# Altium schematic sheet Choin_tran1_0.SchDoc
size A3; DocumentNumber: 3; SheetNumber: 3; SheetTotal: 4; LotOfPieces: 1
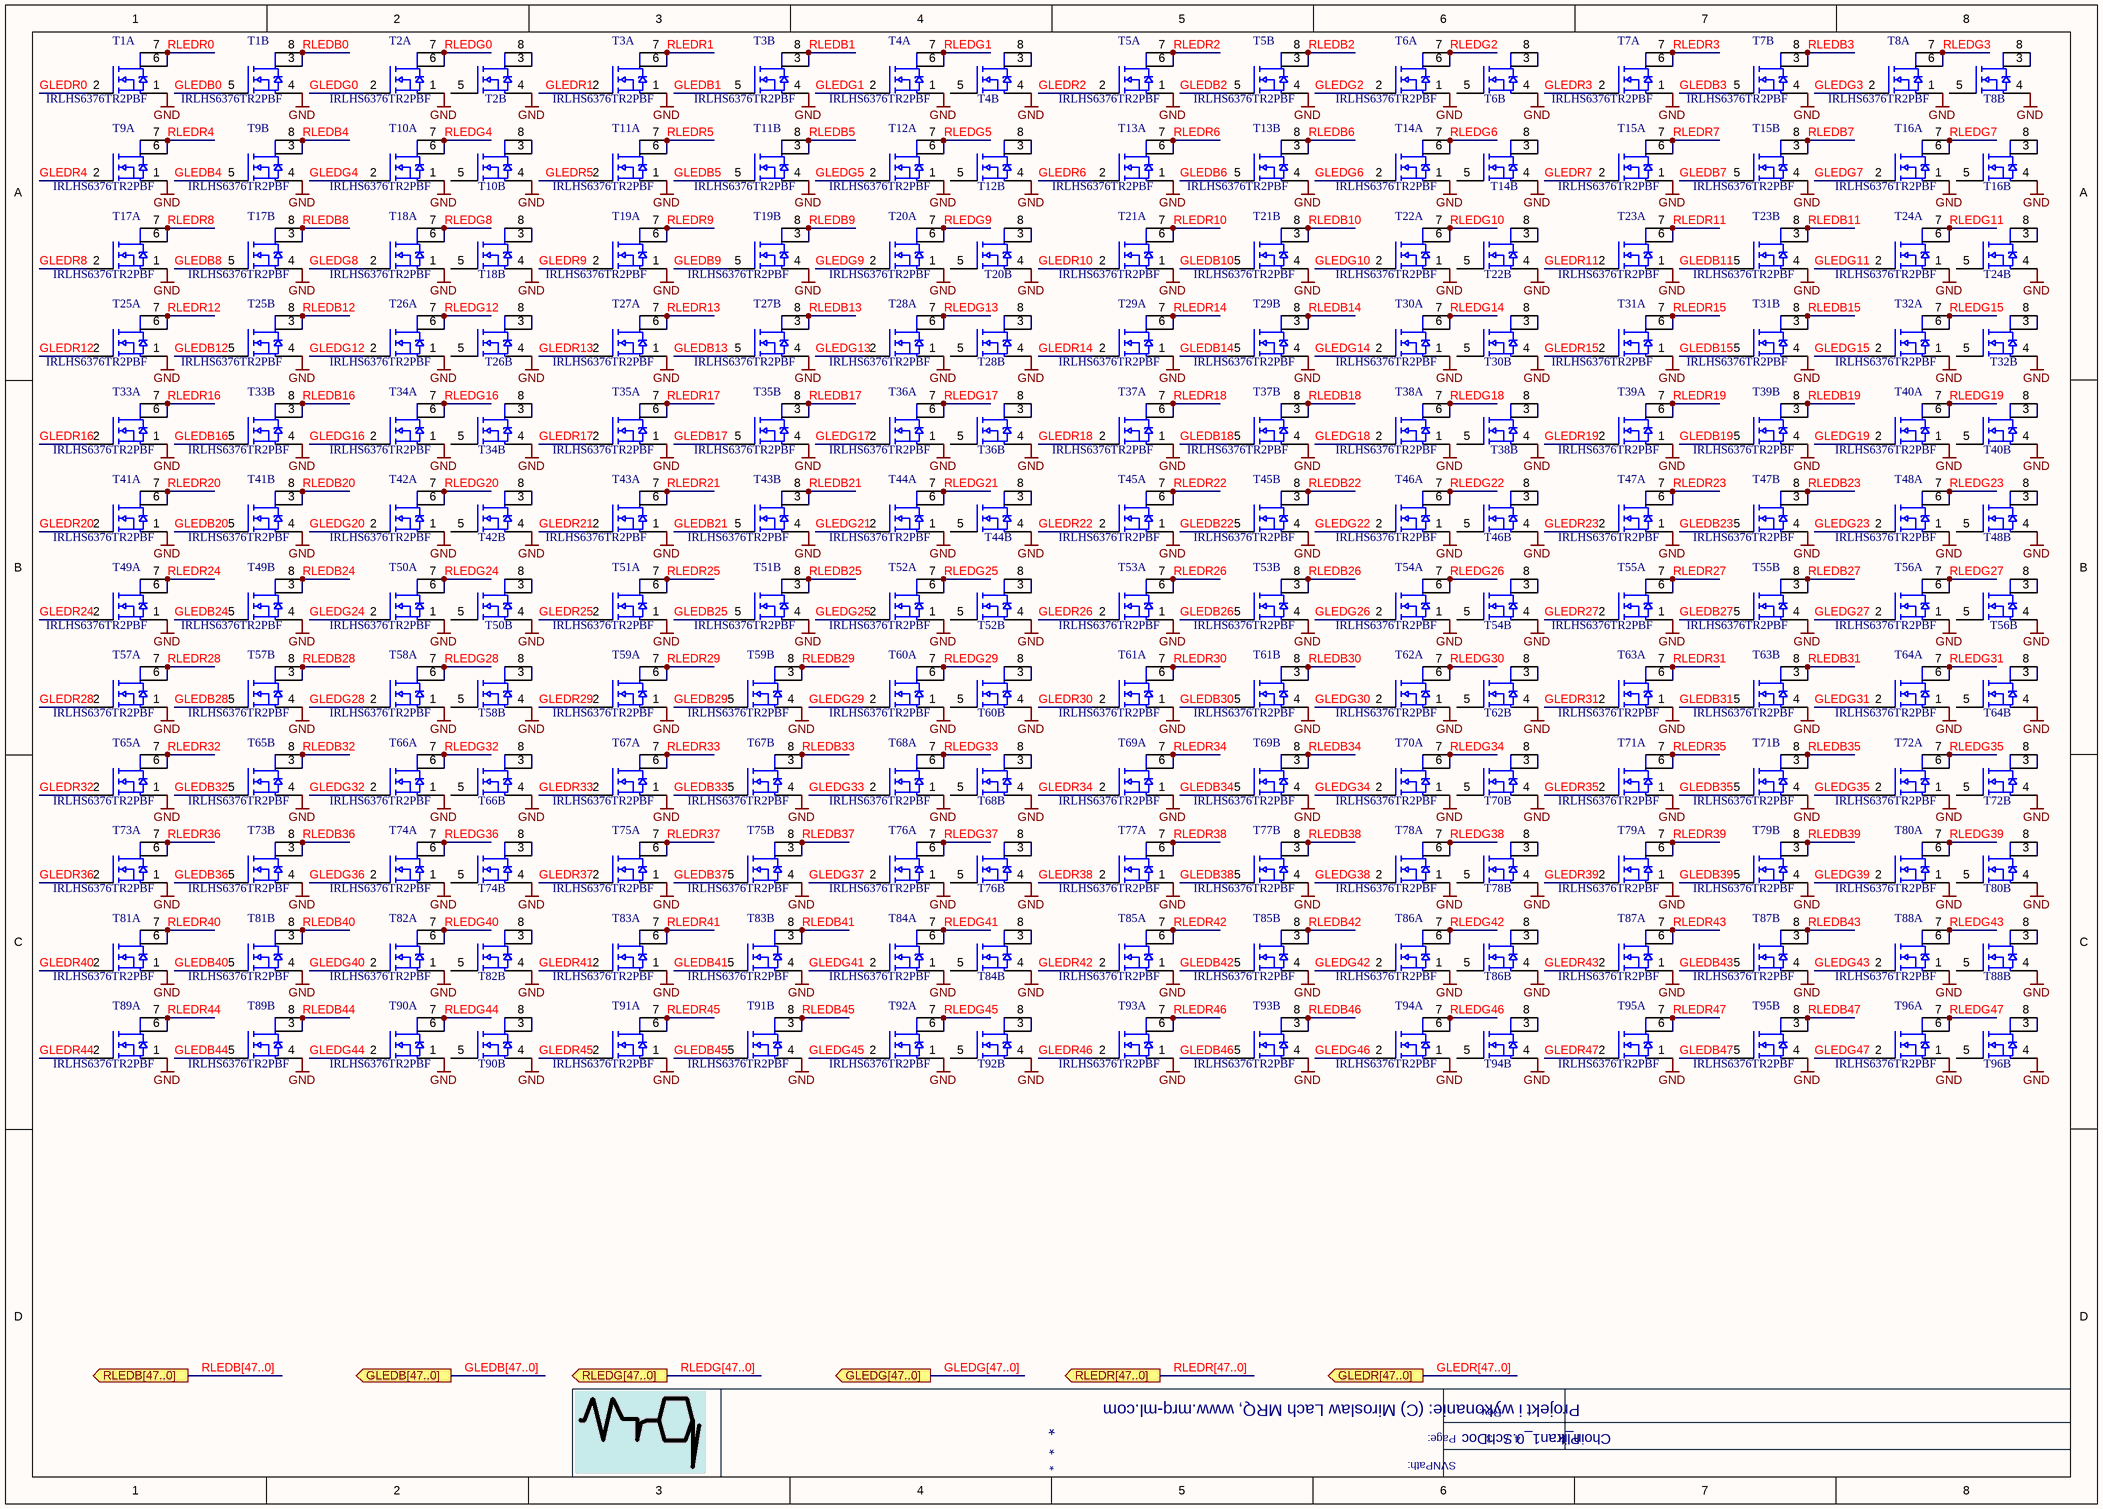
[diagram p0: Choin_tran1_0.SchDoc]

## Parts
T1  IRLHS6376TR2PBF  [PQFN2X2DUAL]  (parts A,B of 2)
T2  IRLHS6376TR2PBF  [PQFN2X2DUAL]  (parts A,B of 2)
T3  IRLHS6376TR2PBF  [PQFN2X2DUAL]  (parts A,B of 2)
T4  IRLHS6376TR2PBF  [PQFN2X2DUAL]  (parts A,B of 2)
T5  IRLHS6376TR2PBF  [PQFN2X2DUAL]  (parts A,B of 2)
T6  IRLHS6376TR2PBF  [PQFN2X2DUAL]  (parts A,B of 2)
T7  IRLHS6376TR2PBF  [PQFN2X2DUAL]  (parts A,B of 2)
T8  IRLHS6376TR2PBF  [PQFN2X2DUAL]  (parts A,B of 2)
T9  IRLHS6376TR2PBF  [PQFN2X2DUAL]  (parts A,B of 2)
T10  IRLHS6376TR2PBF  [PQFN2X2DUAL]  (parts A,B of 2)
T11  IRLHS6376TR2PBF  [PQFN2X2DUAL]  (parts A,B of 2)
T12  IRLHS6376TR2PBF  [PQFN2X2DUAL]  (parts A,B of 2)
T13  IRLHS6376TR2PBF  [PQFN2X2DUAL]  (parts A,B of 2)
T14  IRLHS6376TR2PBF  [PQFN2X2DUAL]  (parts A,B of 2)
T15  IRLHS6376TR2PBF  [PQFN2X2DUAL]  (parts A,B of 2)
T16  IRLHS6376TR2PBF  [PQFN2X2DUAL]  (parts A,B of 2)
T17  IRLHS6376TR2PBF  [PQFN2X2DUAL]  (parts A,B of 2)
T18  IRLHS6376TR2PBF  [PQFN2X2DUAL]  (parts A,B of 2)
T19  IRLHS6376TR2PBF  [PQFN2X2DUAL]  (parts A,B of 2)
T20  IRLHS6376TR2PBF  [PQFN2X2DUAL]  (parts A,B of 2)
T21  IRLHS6376TR2PBF  [PQFN2X2DUAL]  (parts A,B of 2)
T22  IRLHS6376TR2PBF  [PQFN2X2DUAL]  (parts A,B of 2)
T23  IRLHS6376TR2PBF  [PQFN2X2DUAL]  (parts A,B of 2)
T24  IRLHS6376TR2PBF  [PQFN2X2DUAL]  (parts A,B of 2)
T25  IRLHS6376TR2PBF  [PQFN2X2DUAL]  (parts A,B of 2)
T26  IRLHS6376TR2PBF  [PQFN2X2DUAL]  (parts A,B of 2)
T27  IRLHS6376TR2PBF  [PQFN2X2DUAL]  (parts A,B of 2)
T28  IRLHS6376TR2PBF  [PQFN2X2DUAL]  (parts A,B of 2)
T29  IRLHS6376TR2PBF  [PQFN2X2DUAL]  (parts A,B of 2)
T30  IRLHS6376TR2PBF  [PQFN2X2DUAL]  (parts A,B of 2)
T31  IRLHS6376TR2PBF  [PQFN2X2DUAL]  (parts A,B of 2)
T32  IRLHS6376TR2PBF  [PQFN2X2DUAL]  (parts A,B of 2)
T33  IRLHS6376TR2PBF  [PQFN2X2DUAL]  (parts A,B of 2)
T34  IRLHS6376TR2PBF  [PQFN2X2DUAL]  (parts A,B of 2)
T35  IRLHS6376TR2PBF  [PQFN2X2DUAL]  (parts A,B of 2)
T36  IRLHS6376TR2PBF  [PQFN2X2DUAL]  (parts A,B of 2)
T37  IRLHS6376TR2PBF  [PQFN2X2DUAL]  (parts A,B of 2)
T38  IRLHS6376TR2PBF  [PQFN2X2DUAL]  (parts A,B of 2)
T39  IRLHS6376TR2PBF  [PQFN2X2DUAL]  (parts A,B of 2)
T40  IRLHS6376TR2PBF  [PQFN2X2DUAL]  (parts A,B of 2)
T41  IRLHS6376TR2PBF  [PQFN2X2DUAL]  (parts A,B of 2)
T42  IRLHS6376TR2PBF  [PQFN2X2DUAL]  (parts A,B of 2)
T43  IRLHS6376TR2PBF  [PQFN2X2DUAL]  (parts A,B of 2)
T44  IRLHS6376TR2PBF  [PQFN2X2DUAL]  (parts A,B of 2)
T45  IRLHS6376TR2PBF  [PQFN2X2DUAL]  (parts A,B of 2)
T46  IRLHS6376TR2PBF  [PQFN2X2DUAL]  (parts A,B of 2)
T47  IRLHS6376TR2PBF  [PQFN2X2DUAL]  (parts A,B of 2)
T48  IRLHS6376TR2PBF  [PQFN2X2DUAL]  (parts A,B of 2)
T49  IRLHS6376TR2PBF  [PQFN2X2DUAL]  (parts A,B of 2)
T50  IRLHS6376TR2PBF  [PQFN2X2DUAL]  (parts A,B of 2)
T51  IRLHS6376TR2PBF  [PQFN2X2DUAL]  (parts A,B of 2)
T52  IRLHS6376TR2PBF  [PQFN2X2DUAL]  (parts A,B of 2)
T53  IRLHS6376TR2PBF  [PQFN2X2DUAL]  (parts A,B of 2)
T54  IRLHS6376TR2PBF  [PQFN2X2DUAL]  (parts A,B of 2)
T55  IRLHS6376TR2PBF  [PQFN2X2DUAL]  (parts A,B of 2)
T56  IRLHS6376TR2PBF  [PQFN2X2DUAL]  (parts A,B of 2)
T57  IRLHS6376TR2PBF  [PQFN2X2DUAL]  (parts A,B of 2)
T58  IRLHS6376TR2PBF  [PQFN2X2DUAL]  (parts A,B of 2)
T59  IRLHS6376TR2PBF  [PQFN2X2DUAL]  (parts A,B of 2)
T60  IRLHS6376TR2PBF  [PQFN2X2DUAL]  (parts A,B of 2)
T61  IRLHS6376TR2PBF  [PQFN2X2DUAL]  (parts A,B of 2)
T62  IRLHS6376TR2PBF  [PQFN2X2DUAL]  (parts A,B of 2)
T63  IRLHS6376TR2PBF  [PQFN2X2DUAL]  (parts A,B of 2)
T64  IRLHS6376TR2PBF  [PQFN2X2DUAL]  (parts A,B of 2)
T65  IRLHS6376TR2PBF  [PQFN2X2DUAL]  (parts A,B of 2)
T66  IRLHS6376TR2PBF  [PQFN2X2DUAL]  (parts A,B of 2)
T67  IRLHS6376TR2PBF  [PQFN2X2DUAL]  (parts A,B of 2)
T68  IRLHS6376TR2PBF  [PQFN2X2DUAL]  (parts A,B of 2)
T69  IRLHS6376TR2PBF  [PQFN2X2DUAL]  (parts A,B of 2)
T70  IRLHS6376TR2PBF  [PQFN2X2DUAL]  (parts A,B of 2)
T71  IRLHS6376TR2PBF  [PQFN2X2DUAL]  (parts A,B of 2)
T72  IRLHS6376TR2PBF  [PQFN2X2DUAL]  (parts A,B of 2)
T73  IRLHS6376TR2PBF  [PQFN2X2DUAL]  (parts A,B of 2)
T74  IRLHS6376TR2PBF  [PQFN2X2DUAL]  (parts A,B of 2)
T75  IRLHS6376TR2PBF  [PQFN2X2DUAL]  (parts A,B of 2)
T76  IRLHS6376TR2PBF  [PQFN2X2DUAL]  (parts A,B of 2)
T77  IRLHS6376TR2PBF  [PQFN2X2DUAL]  (parts A,B of 2)
T78  IRLHS6376TR2PBF  [PQFN2X2DUAL]  (parts A,B of 2)
T79  IRLHS6376TR2PBF  [PQFN2X2DUAL]  (parts A,B of 2)
T80  IRLHS6376TR2PBF  [PQFN2X2DUAL]  (parts A,B of 2)
T81  IRLHS6376TR2PBF  [PQFN2X2DUAL]  (parts A,B of 2)
T82  IRLHS6376TR2PBF  [PQFN2X2DUAL]  (parts A,B of 2)
T83  IRLHS6376TR2PBF  [PQFN2X2DUAL]  (parts A,B of 2)
T84  IRLHS6376TR2PBF  [PQFN2X2DUAL]  (parts A,B of 2)
T85  IRLHS6376TR2PBF  [PQFN2X2DUAL]  (parts A,B of 2)
T86  IRLHS6376TR2PBF  [PQFN2X2DUAL]  (parts A,B of 2)
T87  IRLHS6376TR2PBF  [PQFN2X2DUAL]  (parts A,B of 2)
T88  IRLHS6376TR2PBF  [PQFN2X2DUAL]  (parts A,B of 2)
T89  IRLHS6376TR2PBF  [PQFN2X2DUAL]  (parts A,B of 2)
T90  IRLHS6376TR2PBF  [PQFN2X2DUAL]  (parts A,B of 2)
T91  IRLHS6376TR2PBF  [PQFN2X2DUAL]  (parts A,B of 2)
T92  IRLHS6376TR2PBF  [PQFN2X2DUAL]  (parts A,B of 2)
T93  IRLHS6376TR2PBF  [PQFN2X2DUAL]  (parts A,B of 2)
T94  IRLHS6376TR2PBF  [PQFN2X2DUAL]  (parts A,B of 2)
T95  IRLHS6376TR2PBF  [PQFN2X2DUAL]  (parts A,B of 2)
T96  IRLHS6376TR2PBF  [PQFN2X2DUAL]  (parts A,B of 2)

## Ports
GLEDB[47..0], GLEDG[47..0], GLEDR[47..0], RLEDB[47..0], RLEDG[47..0], RLEDR[47..0]

## Nets
GND: T1.1(S1) T1.4(S2) T2.1(S1) T2.4(S2) T3.1(S1) T3.4(S2) T4.1(S1) T4.4(S2) T5.1(S1) T5.4(S2) T6.1(S1) T6.4(S2) T7.1(S1) T7.4(S2) T8.1(S1) T8.4(S2) T9.1(S1) T9.4(S2) T10.1(S1) T10.4(S2) T11.1(S1) T11.4(S2) T12.1(S1) T12.4(S2) T13.1(S1) T13.4(S2) T14.1(S1) T14.4(S2) T15.1(S1) T15.4(S2) T16.1(S1) T16.4(S2) T17.1(S1) T17.4(S2) T18.1(S1) T18.4(S2) T19.1(S1) T19.4(S2) T20.1(S1) T20.4(S2) T21.1(S1) T21.4(S2) T22.1(S1) T22.4(S2) T23.1(S1) T23.4(S2) T24.1(S1) T24.4(S2) T25.1(S1) T25.4(S2) T26.1(S1) T26.4(S2) T27.1(S1) T27.4(S2) T28.1(S1) T28.4(S2) T29.1(S1) T29.4(S2) T30.1(S1) T30.4(S2) T31.1(S1) T31.4(S2) T32.1(S1) T32.4(S2) T33.1(S1) T33.4(S2) T34.1(S1) T34.4(S2) T35.1(S1) T35.4(S2) T36.1(S1) T36.4(S2) T37.1(S1) T37.4(S2) T38.1(S1) T38.4(S2) T39.1(S1) T39.4(S2) T40.1(S1) T40.4(S2) T41.1(S1) T41.4(S2) T42.1(S1) T42.4(S2) T43.1(S1) T43.4(S2) T44.1(S1) T44.4(S2) T45.1(S1) T45.4(S2) T46.1(S1) T46.4(S2) T47.1(S1) T47.4(S2) T48.1(S1) T48.4(S2) T49.1(S1) T49.4(S2) T50.1(S1) T50.4(S2) T51.1(S1) T51.4(S2) T52.1(S1) T52.4(S2) T53.1(S1) T53.4(S2) T54.1(S1) T54.4(S2) T55.1(S1) T55.4(S2) T56.1(S1) T56.4(S2) T57.1(S1) T57.4(S2) T58.1(S1) T58.4(S2) T59.1(S1) T59.4(S2) T60.1(S1) T60.4(S2) T61.1(S1) T61.4(S2) T62.1(S1) T62.4(S2) T63.1(S1) T63.4(S2) T64.1(S1) T64.4(S2) T65.1(S1) T65.4(S2) T66.1(S1) T66.4(S2) T67.1(S1) T67.4(S2) T68.1(S1) T68.4(S2) T69.1(S1) T69.4(S2) T70.1(S1) T70.4(S2) T71.1(S1) T71.4(S2) T72.1(S1) T72.4(S2) T73.1(S1) T73.4(S2) T74.1(S1) T74.4(S2) T75.1(S1) T75.4(S2) T76.1(S1) T76.4(S2) T77.1(S1) T77.4(S2) T78.1(S1) T78.4(S2) T79.1(S1) T79.4(S2) T80.1(S1) T80.4(S2) T81.1(S1) T81.4(S2) T82.1(S1) T82.4(S2) T83.1(S1) T83.4(S2) T84.1(S1) T84.4(S2) T85.1(S1) T85.4(S2) T86.1(S1) T86.4(S2) T87.1(S1) T87.4(S2) T88.1(S1) T88.4(S2) T89.1(S1) T89.4(S2) T90.1(S1) T90.4(S2) T91.1(S1) T91.4(S2) T92.1(S1) T92.4(S2) T93.1(S1) T93.4(S2) T94.1(S1) T94.4(S2) T95.1(S1) T95.4(S2) T96.1(S1) T96.4(S2)
GLEDB0: T1.5(G2)
GLEDB1: T3.5(G2)
GLEDB2: T5.5(G2)
GLEDB3: T7.5(G2)
GLEDB4: T9.5(G2)
GLEDB5: T11.5(G2)
GLEDB6: T13.5(G2)
GLEDB7: T15.5(G2)
GLEDB8: T17.5(G2)
GLEDB9: T19.5(G2)
GLEDB10: T21.5(G2)
GLEDB11: T23.5(G2)
GLEDB12: T25.5(G2)
GLEDB13: T27.5(G2)
GLEDB14: T29.5(G2)
GLEDB15: T31.5(G2)
GLEDB16: T33.5(G2)
GLEDB17: T35.5(G2)
GLEDB18: T37.5(G2)
GLEDB19: T39.5(G2)
GLEDB20: T41.5(G2)
GLEDB21: T43.5(G2)
GLEDB22: T45.5(G2)
GLEDB23: T47.5(G2)
GLEDB24: T49.5(G2)
GLEDB25: T51.5(G2)
GLEDB26: T53.5(G2)
GLEDB27: T55.5(G2)
GLEDB28: T57.5(G2)
GLEDB29: T59.5(G2)
GLEDB30: T61.5(G2)
GLEDB31: T63.5(G2)
GLEDB32: T65.5(G2)
GLEDB33: T67.5(G2)
GLEDB34: T69.5(G2)
GLEDB35: T71.5(G2)
GLEDB36: T73.5(G2)
GLEDB37: T75.5(G2)
GLEDB38: T77.5(G2)
GLEDB39: T79.5(G2)
GLEDB40: T81.5(G2)
GLEDB41: T83.5(G2)
GLEDB42: T85.5(G2)
GLEDB43: T87.5(G2)
GLEDB44: T89.5(G2)
GLEDB45: T91.5(G2)
GLEDB46: T93.5(G2)
GLEDB47: T95.5(G2)
GLEDG0: T2.2(G1)
GLEDG1: T4.2(G1)
GLEDG2: T6.2(G1)
GLEDG3: T8.2(G1)
GLEDG4: T10.2(G1)
GLEDG5: T12.2(G1)
GLEDG6: T14.2(G1)
GLEDG7: T16.2(G1)
GLEDG8: T18.2(G1)
GLEDG9: T20.2(G1)
GLEDG10: T22.2(G1)
GLEDG11: T24.2(G1)
GLEDG12: T26.2(G1)
GLEDG13: T28.2(G1)
GLEDG14: T30.2(G1)
GLEDG15: T32.2(G1)
GLEDG16: T34.2(G1)
GLEDG17: T36.2(G1)
GLEDG18: T38.2(G1)
GLEDG19: T40.2(G1)
GLEDG20: T42.2(G1)
GLEDG21: T44.2(G1)
GLEDG22: T46.2(G1)
GLEDG23: T48.2(G1)
GLEDG24: T50.2(G1)
GLEDG25: T52.2(G1)
GLEDG26: T54.2(G1)
GLEDG27: T56.2(G1)
GLEDG28: T58.2(G1)
GLEDG29: T60.2(G1)
GLEDG30: T62.2(G1)
GLEDG31: T64.2(G1)
GLEDG32: T66.2(G1)
GLEDG33: T68.2(G1)
GLEDG34: T70.2(G1)
GLEDG35: T72.2(G1)
GLEDG36: T74.2(G1)
GLEDG37: T76.2(G1)
GLEDG38: T78.2(G1)
GLEDG39: T80.2(G1)
GLEDG40: T82.2(G1)
GLEDG41: T84.2(G1)
GLEDG42: T86.2(G1)
GLEDG43: T88.2(G1)
GLEDG44: T90.2(G1)
GLEDG45: T92.2(G1)
GLEDG46: T94.2(G1)
GLEDG47: T96.2(G1)
GLEDR0: T1.2(G1)
GLEDR1: T3.2(G1)
GLEDR2: T5.2(G1)
GLEDR3: T7.2(G1)
GLEDR4: T9.2(G1)
GLEDR5: T11.2(G1)
GLEDR6: T13.2(G1)
GLEDR7: T15.2(G1)
GLEDR8: T17.2(G1)
GLEDR9: T19.2(G1)
GLEDR10: T21.2(G1)
GLEDR11: T23.2(G1)
GLEDR12: T25.2(G1)
GLEDR13: T27.2(G1)
GLEDR14: T29.2(G1)
GLEDR15: T31.2(G1)
GLEDR16: T33.2(G1)
GLEDR17: T35.2(G1)
GLEDR18: T37.2(G1)
GLEDR19: T39.2(G1)
GLEDR20: T41.2(G1)
GLEDR21: T43.2(G1)
GLEDR22: T45.2(G1)
GLEDR23: T47.2(G1)
GLEDR24: T49.2(G1)
GLEDR25: T51.2(G1)
GLEDR26: T53.2(G1)
GLEDR27: T55.2(G1)
GLEDR28: T57.2(G1)
GLEDR29: T59.2(G1)
GLEDR30: T61.2(G1)
GLEDR31: T63.2(G1)
GLEDR32: T65.2(G1)
GLEDR33: T67.2(G1)
GLEDR34: T69.2(G1)
GLEDR35: T71.2(G1)
GLEDR36: T73.2(G1)
GLEDR37: T75.2(G1)
GLEDR38: T77.2(G1)
GLEDR39: T79.2(G1)
GLEDR40: T81.2(G1)
GLEDR41: T83.2(G1)
GLEDR42: T85.2(G1)
GLEDR43: T87.2(G1)
GLEDR44: T89.2(G1)
GLEDR45: T91.2(G1)
GLEDR46: T93.2(G1)
GLEDR47: T95.2(G1)
RLEDB0: T1.3(D2) T1.8(D2)
RLEDB1: T3.3(D2) T3.8(D2)
RLEDB2: T5.3(D2) T5.8(D2)
RLEDB3: T7.3(D2) T7.8(D2)
RLEDB4: T9.3(D2) T9.8(D2)
RLEDB5: T11.3(D2) T11.8(D2)
RLEDB6: T13.3(D2) T13.8(D2)
RLEDB7: T15.3(D2) T15.8(D2)
RLEDB8: T17.3(D2) T17.8(D2)
RLEDB9: T19.3(D2) T19.8(D2)
RLEDB10: T21.3(D2) T21.8(D2)
RLEDB11: T23.3(D2) T23.8(D2)
RLEDB12: T25.3(D2) T25.8(D2)
RLEDB13: T27.3(D2) T27.8(D2)
RLEDB14: T29.3(D2) T29.8(D2)
RLEDB15: T31.3(D2) T31.8(D2)
RLEDB16: T33.3(D2) T33.8(D2)
RLEDB17: T35.3(D2) T35.8(D2)
RLEDB18: T37.3(D2) T37.8(D2)
RLEDB19: T39.3(D2) T39.8(D2)
RLEDB20: T41.3(D2) T41.8(D2)
RLEDB21: T43.3(D2) T43.8(D2)
RLEDB22: T45.3(D2) T45.8(D2)
RLEDB23: T47.3(D2) T47.8(D2)
RLEDB24: T49.3(D2) T49.8(D2)
RLEDB25: T51.3(D2) T51.8(D2)
RLEDB26: T53.3(D2) T53.8(D2)
RLEDB27: T55.3(D2) T55.8(D2)
RLEDB28: T57.3(D2) T57.8(D2)
RLEDB29: T59.3(D2) T59.8(D2)
RLEDB30: T61.3(D2) T61.8(D2)
RLEDB31: T63.3(D2) T63.8(D2)
RLEDB32: T65.3(D2) T65.8(D2)
RLEDB33: T67.3(D2) T67.8(D2)
RLEDB34: T69.3(D2) T69.8(D2)
RLEDB35: T71.3(D2) T71.8(D2)
RLEDB36: T73.3(D2) T73.8(D2)
RLEDB37: T75.3(D2) T75.8(D2)
RLEDB38: T77.3(D2) T77.8(D2)
RLEDB39: T79.3(D2) T79.8(D2)
RLEDB40: T81.3(D2) T81.8(D2)
RLEDB41: T83.3(D2) T83.8(D2)
RLEDB42: T85.3(D2) T85.8(D2)
RLEDB43: T87.3(D2) T87.8(D2)
RLEDB44: T89.3(D2) T89.8(D2)
RLEDB45: T91.3(D2) T91.8(D2)
RLEDB46: T93.3(D2) T93.8(D2)
RLEDB47: T95.3(D2) T95.8(D2)
RLEDG0: T2.6(D1) T2.7(D1)
RLEDG1: T4.6(D1) T4.7(D1)
RLEDG2: T6.6(D1) T6.7(D1)
RLEDG3: T8.6(D1) T8.7(D1)
RLEDG4: T10.6(D1) T10.7(D1)
RLEDG5: T12.6(D1) T12.7(D1)
RLEDG6: T14.6(D1) T14.7(D1)
RLEDG7: T16.6(D1) T16.7(D1)
RLEDG8: T18.6(D1) T18.7(D1)
RLEDG9: T20.6(D1) T20.7(D1)
RLEDG10: T22.6(D1) T22.7(D1)
RLEDG11: T24.6(D1) T24.7(D1)
RLEDG12: T26.6(D1) T26.7(D1)
RLEDG13: T28.6(D1) T28.7(D1)
RLEDG14: T30.6(D1) T30.7(D1)
RLEDG15: T32.6(D1) T32.7(D1)
RLEDG16: T34.6(D1) T34.7(D1)
RLEDG17: T36.6(D1) T36.7(D1)
RLEDG18: T38.6(D1) T38.7(D1)
RLEDG19: T40.6(D1) T40.7(D1)
RLEDG20: T42.6(D1) T42.7(D1)
RLEDG21: T44.6(D1) T44.7(D1)
RLEDG22: T46.6(D1) T46.7(D1)
RLEDG23: T48.6(D1) T48.7(D1)
RLEDG24: T50.6(D1) T50.7(D1)
RLEDG25: T52.6(D1) T52.7(D1)
RLEDG26: T54.6(D1) T54.7(D1)
RLEDG27: T56.6(D1) T56.7(D1)
RLEDG28: T58.6(D1) T58.7(D1)
RLEDG29: T60.6(D1) T60.7(D1)
RLEDG30: T62.6(D1) T62.7(D1)
RLEDG31: T64.6(D1) T64.7(D1)
RLEDG32: T66.6(D1) T66.7(D1)
RLEDG33: T68.6(D1) T68.7(D1)
RLEDG34: T70.6(D1) T70.7(D1)
RLEDG35: T72.6(D1) T72.7(D1)
RLEDG36: T74.6(D1) T74.7(D1)
RLEDG37: T76.6(D1) T76.7(D1)
RLEDG38: T78.6(D1) T78.7(D1)
RLEDG39: T80.6(D1) T80.7(D1)
RLEDG40: T82.6(D1) T82.7(D1)
RLEDG41: T84.6(D1) T84.7(D1)
RLEDG42: T86.6(D1) T86.7(D1)
RLEDG43: T88.6(D1) T88.7(D1)
RLEDG44: T90.6(D1) T90.7(D1)
RLEDG45: T92.6(D1) T92.7(D1)
RLEDG46: T94.6(D1) T94.7(D1)
RLEDG47: T96.6(D1) T96.7(D1)
RLEDR0: T1.6(D1) T1.7(D1)
RLEDR1: T3.6(D1) T3.7(D1)
RLEDR2: T5.6(D1) T5.7(D1)
RLEDR3: T7.6(D1) T7.7(D1)
RLEDR4: T9.6(D1) T9.7(D1)
RLEDR5: T11.6(D1) T11.7(D1)
RLEDR6: T13.6(D1) T13.7(D1)
RLEDR7: T15.6(D1) T15.7(D1)
RLEDR8: T17.6(D1) T17.7(D1)
RLEDR9: T19.6(D1) T19.7(D1)
RLEDR10: T21.6(D1) T21.7(D1)
RLEDR11: T23.6(D1) T23.7(D1)
RLEDR12: T25.6(D1) T25.7(D1)
RLEDR13: T27.6(D1) T27.7(D1)
RLEDR14: T29.6(D1) T29.7(D1)
RLEDR15: T31.6(D1) T31.7(D1)
RLEDR16: T33.6(D1) T33.7(D1)
RLEDR17: T35.6(D1) T35.7(D1)
RLEDR18: T37.6(D1) T37.7(D1)
RLEDR19: T39.6(D1) T39.7(D1)
RLEDR20: T41.6(D1) T41.7(D1)
RLEDR21: T43.6(D1) T43.7(D1)
RLEDR22: T45.6(D1) T45.7(D1)
RLEDR23: T47.6(D1) T47.7(D1)
RLEDR24: T49.6(D1) T49.7(D1)
RLEDR25: T51.6(D1) T51.7(D1)
RLEDR26: T53.6(D1) T53.7(D1)
RLEDR27: T55.6(D1) T55.7(D1)
RLEDR28: T57.6(D1) T57.7(D1)
RLEDR29: T59.6(D1) T59.7(D1)
RLEDR30: T61.6(D1) T61.7(D1)
RLEDR31: T63.6(D1) T63.7(D1)
RLEDR32: T65.6(D1) T65.7(D1)
RLEDR33: T67.6(D1) T67.7(D1)
RLEDR34: T69.6(D1) T69.7(D1)
RLEDR35: T71.6(D1) T71.7(D1)
RLEDR36: T73.6(D1) T73.7(D1)
RLEDR37: T75.6(D1) T75.7(D1)
RLEDR38: T77.6(D1) T77.7(D1)
RLEDR39: T79.6(D1) T79.7(D1)
RLEDR40: T81.6(D1) T81.7(D1)
RLEDR41: T83.6(D1) T83.7(D1)
RLEDR42: T85.6(D1) T85.7(D1)
RLEDR43: T87.6(D1) T87.7(D1)
RLEDR44: T89.6(D1) T89.7(D1)
RLEDR45: T91.6(D1) T91.7(D1)
RLEDR46: T93.6(D1) T93.7(D1)
RLEDR47: T95.6(D1) T95.7(D1)
NetT2_3: T2.3(D2) T2.8(D2)
NetT4_3: T4.3(D2) T4.8(D2)
NetT6_3: T6.3(D2) T6.8(D2)
NetT8_3: T8.3(D2) T8.8(D2)
NetT10_3: T10.3(D2) T10.8(D2)
NetT12_3: T12.3(D2) T12.8(D2)
NetT14_3: T14.3(D2) T14.8(D2)
NetT16_3: T16.3(D2) T16.8(D2)
NetT18_3: T18.3(D2) T18.8(D2)
NetT20_3: T20.3(D2) T20.8(D2)
NetT22_3: T22.3(D2) T22.8(D2)
NetT24_3: T24.3(D2) T24.8(D2)
NetT26_3: T26.3(D2) T26.8(D2)
NetT28_3: T28.3(D2) T28.8(D2)
NetT30_3: T30.3(D2) T30.8(D2)
NetT32_3: T32.3(D2) T32.8(D2)
NetT34_3: T34.3(D2) T34.8(D2)
NetT36_3: T36.3(D2) T36.8(D2)
NetT38_3: T38.3(D2) T38.8(D2)
NetT40_3: T40.3(D2) T40.8(D2)
NetT42_3: T42.3(D2) T42.8(D2)
NetT44_3: T44.3(D2) T44.8(D2)
NetT46_3: T46.3(D2) T46.8(D2)
NetT48_3: T48.3(D2) T48.8(D2)
NetT50_3: T50.3(D2) T50.8(D2)
NetT52_3: T52.3(D2) T52.8(D2)
NetT54_3: T54.3(D2) T54.8(D2)
NetT56_3: T56.3(D2) T56.8(D2)
NetT58_3: T58.3(D2) T58.8(D2)
NetT60_3: T60.3(D2) T60.8(D2)
NetT62_3: T62.3(D2) T62.8(D2)
NetT64_3: T64.3(D2) T64.8(D2)
NetT66_3: T66.3(D2) T66.8(D2)
NetT68_3: T68.3(D2) T68.8(D2)
NetT70_3: T70.3(D2) T70.8(D2)
NetT72_3: T72.3(D2) T72.8(D2)
NetT74_3: T74.3(D2) T74.8(D2)
NetT76_3: T76.3(D2) T76.8(D2)
NetT78_3: T78.3(D2) T78.8(D2)
NetT80_3: T80.3(D2) T80.8(D2)
NetT82_3: T82.3(D2) T82.8(D2)
NetT84_3: T84.3(D2) T84.8(D2)
NetT86_3: T86.3(D2) T86.8(D2)
NetT88_3: T88.3(D2) T88.8(D2)
NetT90_3: T90.3(D2) T90.8(D2)
NetT92_3: T92.3(D2) T92.8(D2)
NetT94_3: T94.3(D2) T94.8(D2)
NetT96_3: T96.3(D2) T96.8(D2)

Not connected (* = marked no-connect by the designer): T2 5(G2); T4 5(G2); T6 5(G2); T8 5(G2); T10 5(G2); T12 5(G2); T14 5(G2); T16 5(G2); T18 5(G2); T20 5(G2); T22 5(G2); T24 5(G2); T26 5(G2); T28 5(G2); T30 5(G2); T32 5(G2); T34 5(G2); T36 5(G2); T38 5(G2); T40 5(G2); T42 5(G2); T44 5(G2); T46 5(G2); T48 5(G2); T50 5(G2); T52 5(G2); T54 5(G2); T56 5(G2); T58 5(G2); T60 5(G2); T62 5(G2); T64 5(G2); T66 5(G2); T68 5(G2); T70 5(G2); T72 5(G2); T74 5(G2); T76 5(G2); T78 5(G2); T80 5(G2); T82 5(G2); T84 5(G2); T86 5(G2); T88 5(G2); T90 5(G2); T92 5(G2); T94 5(G2); T96 5(G2)

## Buses and harness runs
bus GLEDB[47..0] = port GLEDB[47..0]
bus GLEDG[47..0] = port GLEDG[47..0]
bus GLEDR[47..0] = port GLEDR[47..0]
bus RLEDB[47..0] = port RLEDB[47..0]
bus RLEDG[47..0] = port RLEDG[47..0]
bus RLEDR[47..0] = port RLEDR[47..0]

## Notes on the sheet
- Projekt i wykonanie: (C) Miroslaw Lach MRQ, www.mrq-ml.com
- SVNPath:
- Page:
- Rev.
- /
- Plik:

## Library data of the parts
T1-T96 = IRLHS6376TR2PBF[[/\]]PQFN2X2DUAL: Descript: Dual N-cahnnel HEXFET Power MOSFET, 3.4A 30V; Currency5: PLN; Amount5: 5+; Value: IRLHS6376TR2PBF; Dimensions: PQFN2X2DUAL; ComponentLink1Description: Datasheet; ComponentLink1URL: ftp://s2.zenbox.pl:2121/transistors/irlhs6376pbf.pdf; Supplier5: tme.pl; Reference5: IRLHS6376TR2PBF; Manufacturer5: International Rectifier; Typ5: IRLHS6376TR2PBF; Price5: 0,75; DateOfPrice5: 2013-12-28